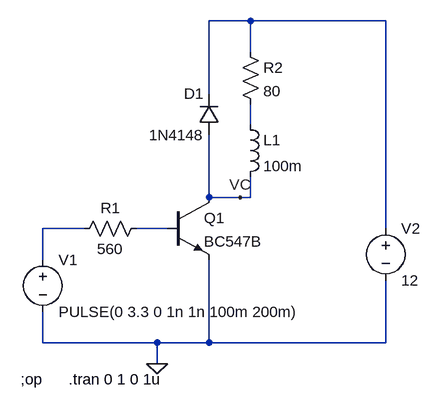
[diagram p0: schematic coilpulse.asc]
coilpulse.asc, the LTspice schematic file:
Version 4
SHEET 1 880 680
WIRE 192 -96 128 -96
WIRE 400 -96 192 -96
WIRE 192 -48 192 -96
WIRE 128 16 128 -96
WIRE 192 64 192 32
WIRE 128 176 128 80
WIRE 176 176 128 176
WIRE 192 176 192 144
WIRE 192 176 176 176
WIRE -64 224 -128 224
WIRE 64 224 16 224
WIRE 400 224 400 -96
WIRE -128 272 -128 224
WIRE -128 400 -128 352
WIRE 48 400 -128 400
WIRE 128 400 128 272
WIRE 128 400 48 400
WIRE 400 400 400 304
WIRE 400 400 128 400
WIRE 48 432 48 400
FLAG 48 432 0
FLAG 176 176 VC
SYMBOL ind 176 48 R0
SYMATTR InstName L1
SYMATTR Value 100m
SYMBOL npn 64 176 R0
SYMATTR InstName Q1
SYMATTR Value BC547B
SYMBOL res 32 208 R90
WINDOW 0 0 56 VBottom 2
WINDOW 3 32 56 VTop 2
SYMATTR InstName R1
SYMATTR Value 560
SYMBOL voltage -128 256 R0
WINDOW 123 0 0 Left 0
WINDOW 39 0 0 Left 0
SYMATTR InstName V1
SYMATTR Value PULSE(0 3.3 0 1n 1n 100m 200m)
SYMBOL voltage 400 208 R0
WINDOW 123 0 0 Left 0
WINDOW 39 0 0 Left 0
SYMATTR InstName V2
SYMATTR Value 12
SYMBOL res 176 -64 R0
SYMATTR InstName R2
SYMATTR Value 80
SYMBOL diode 144 80 R180
WINDOW 0 24 64 Left 2
WINDOW 3 24 0 Left 2
SYMATTR InstName D1
SYMATTR Value 1N4148
TEXT -162 456 Left 2 !;op
TEXT -88 456 Left 2 !.tran 0 1 0 1u

The netlist it stands for:
* coilpulse.asc
L1 N002 VC 100m
Q1 VC N004 0 0 BC547B
R1 N004 N003 560
V1 N003 0 PULSE(0 3.3 0 1n 1n 100m 200m)
V2 N001 0 12
R2 N001 N002 80
D1 VC N001 1N4148
.model D D
.lib standard.dio
.model NPN NPN
.model PNP PNP
.lib standard.bjt
;op
.tran 0 1 0 1u
.backanno
.end